# EAGLE design PiWing (EAGLE 9.0.1)
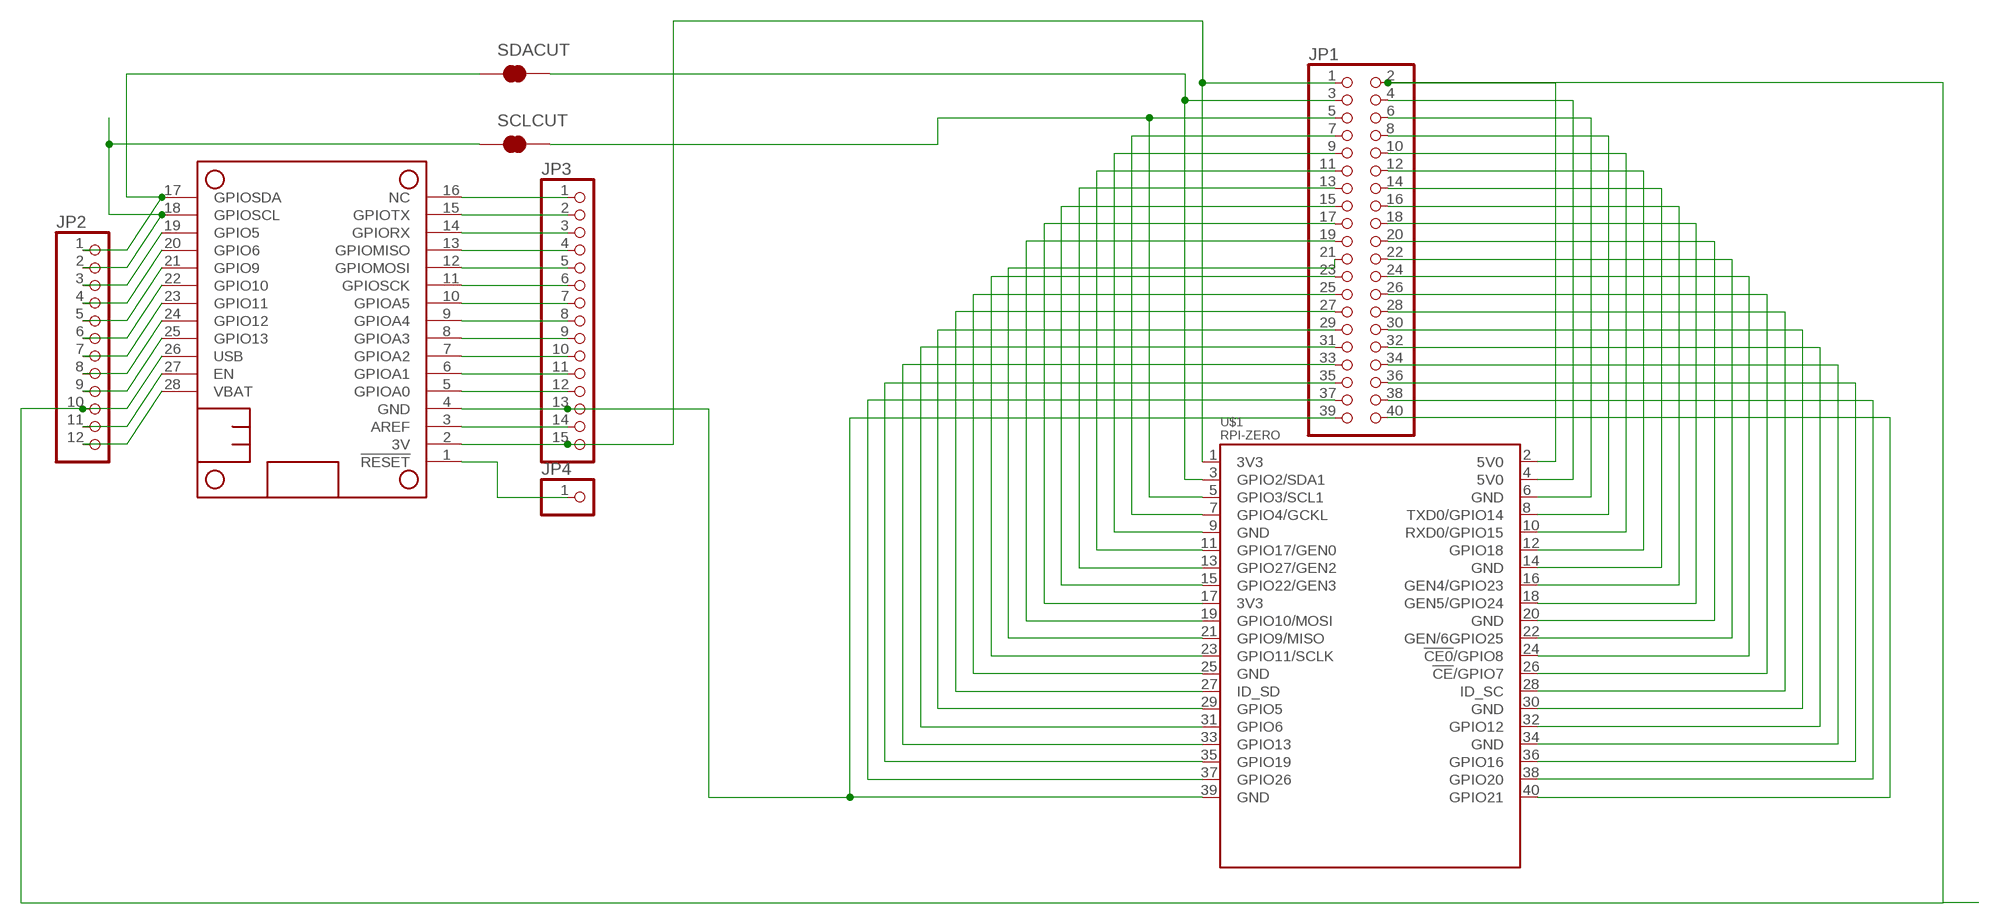
[diagram p0: schematic, sheet 1]

## Parts
JP1  PINHD-2X20-BIG  [2X20-BIG]
JP2  PINHD-1X12-CB  [1X12-CB]
JP3  PINHD-1X15-CB  [1X15-CB]
JP4  PINHD-1X1CB  [1X01-CLEANBIG]
MS1  FEATHERWING_NODIM  [FEATHERWING_DIM]
SCLCUT  JUMPER-SMT_2_NC_TRACE_SILK  [SMT-JUMPER_2_NC_TRACE_SILK]
SDACUT  JUMPER-SMT_2_NC_TRACE_SILK  [SMT-JUMPER_2_NC_TRACE_SILK]
U$1  RPI-ZERO  [RASPBERRYPI_BASTELSTUBE_V13_RASPI_BOARD_B+_FULL]

## Nets
3V: JP1.1 JP3.15 MS1.2(3V) U$1.1(3V3)
3V3@2: JP1.17 U$1.17(3V3)
5V0@2: JP1.4 U$1.4(5V0)
GND@1: JP1.9 U$1.9(GND)
GND@2: JP1.25 U$1.25(GND)
GND@3: JP1.39 JP3.13 MS1.4(GND) U$1.39(GND)
GND@4: JP1.14 U$1.14(GND)
GND@5: JP1.20 U$1.20(GND)
GND@6: JP1.30 U$1.30(GND)
GND@7: JP1.34 U$1.34(GND)
GND@8: JP1.6 U$1.6(GND)
N$1: JP1.3 SDACUT.2 U$1.3(GPIO2/SDA1)
N$2: JP1.5 SCLCUT.2 U$1.5(GPIO3/SCL1)
N$3: JP2.3 MS1.19(GPIO5)
N$4: JP2.4 MS1.20(GPIO6)
N$5: JP2.5 MS1.21(GPIO9)
N$6: JP2.6 MS1.22(GPIO10)
N$7: JP2.7 MS1.23(GPIO11)
N$8: JP2.8 MS1.24(GPIO12)
N$9: JP2.9 MS1.25(GPIO13)
N$10: JP2.11 MS1.27(EN)
N$11: JP3.1 MS1.16(NC)
N$12: JP3.2 MS1.15(GPIOTX)
N$13: JP3.3 MS1.14(GPIORX)
N$14: JP1.21 U$1.21(GPIO9/MISO)
N$15: JP1.19 U$1.19(GPIO10/MOSI)
N$16: JP1.23 U$1.23(GPIO11/SCLK)
N$17: JP3.7 MS1.10(GPIOA5)
N$18: JP3.8 MS1.9(GPIOA4)
N$19: JP3.9 MS1.8(GPIOA3)
N$20: JP3.10 MS1.7(GPIOA2)
N$21: JP3.11 MS1.6(GPIOA1)
N$22: JP3.12 MS1.5(GPIOA0)
N$23: JP3.6 MS1.11(GPIOSCK)
N$24: JP3.14 MS1.3(AREF)
N$25: JP4.1 MS1.1(!RESET)
N$26: JP1.11 U$1.11(GPIO17/GEN0)
N$27: JP3.5 MS1.12(GPIOMOSI)
N$28: JP3.4 MS1.13(GPIOMISO)
N$29: JP1.7 U$1.7(GPIO4/GCKL)
N$30: JP1.13 U$1.13(GPIO27/GEN2)
N$31: JP1.15 U$1.15(GPIO22/GEN3)
N$32: JP1.27 U$1.27(ID_SD)
N$34: JP2.1 MS1.17(GPIOSDA) SDACUT.1
N$35: JP2.2 MS1.18(GPIOSCL) SCLCUT.1
N$36: JP1.29 U$1.29(GPIO5)
N$37: JP1.31 U$1.31(GPIO6)
N$38: JP1.33 U$1.33(GPIO13)
N$39: JP1.35 U$1.35(GPIO19)
N$40: JP1.37 U$1.37(GPIO26)
N$41: JP1.16 U$1.16(GEN4/GPIO23)
N$42: JP1.18 U$1.18(GEN5/GPIO24)
N$43: JP1.8 U$1.8(TXD0/GPIO14)
N$44: JP1.10 U$1.10(RXD0/GPIO15)
N$45: JP1.12 U$1.12(GPIO18)
N$47: JP1.22 U$1.22(GEN/6GPIO25)
N$48: JP1.24 U$1.24(!CE0!/GPIO8)
N$49: JP1.26 U$1.26(!CE!/GPIO7)
N$50: JP1.28 U$1.28(ID_SC)
N$52: JP1.32 U$1.32(GPIO12)
N$54: JP1.36 U$1.36(GPIO16)
N$55: JP1.38 U$1.38(GPIO20)
N$56: JP1.40 U$1.40(GPIO21)
USB: JP1.2 JP2.10 MS1.26(USB) U$1.2(5V0)
VBAT: JP2.12 MS1.28(VBAT)

## Library data of the parts
JP1 = adafruit:PINHD-2X20: PIN HEADER
JP2 = adafruit:PINHD-1X12: PIN HEADER
JP3 = adafruit:PINHD-1X15: PIN HEADER
JP4 = adafruit:PINHD-1X1: Pin header 1x1 for 0.1" spacing With round pins
MS1 = adafruit:FEATHERWING
SCLCUT SDACUT = SparkFun-Jumpers:JUMPER-SMT_2_NC_TRACE: Normally closed trace jumper This jumper has a trace between two pads so it's normally closed (NC). Use a razor knife to open the connection. For best results follow the IPC guidelines for cutting traces: Cutout at least 0.063 mm (0.005 in). Remove all loose material to clean up the cut area. Seal the cut with an approved epoxy. Reapply solder to reclose the connection.
U$1 = RPI-Zero:RPI-ZERO

## Board
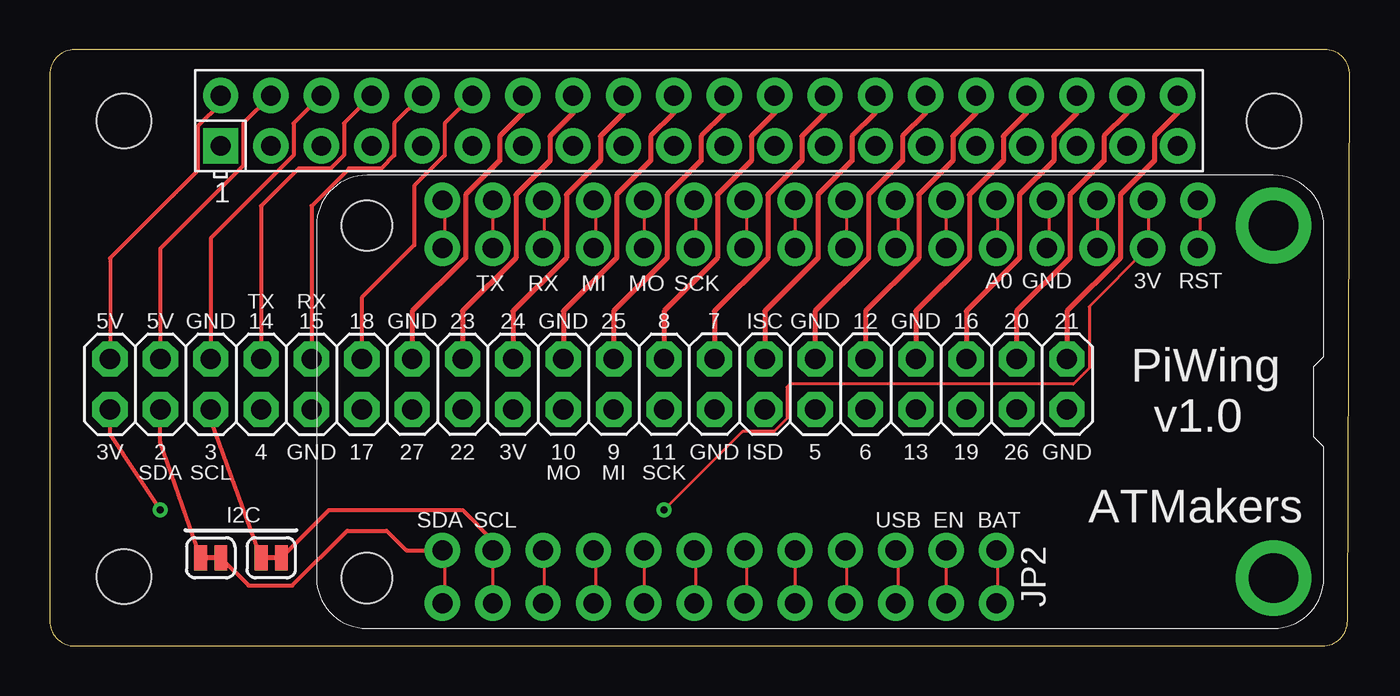
[diagram p1: board, top side]
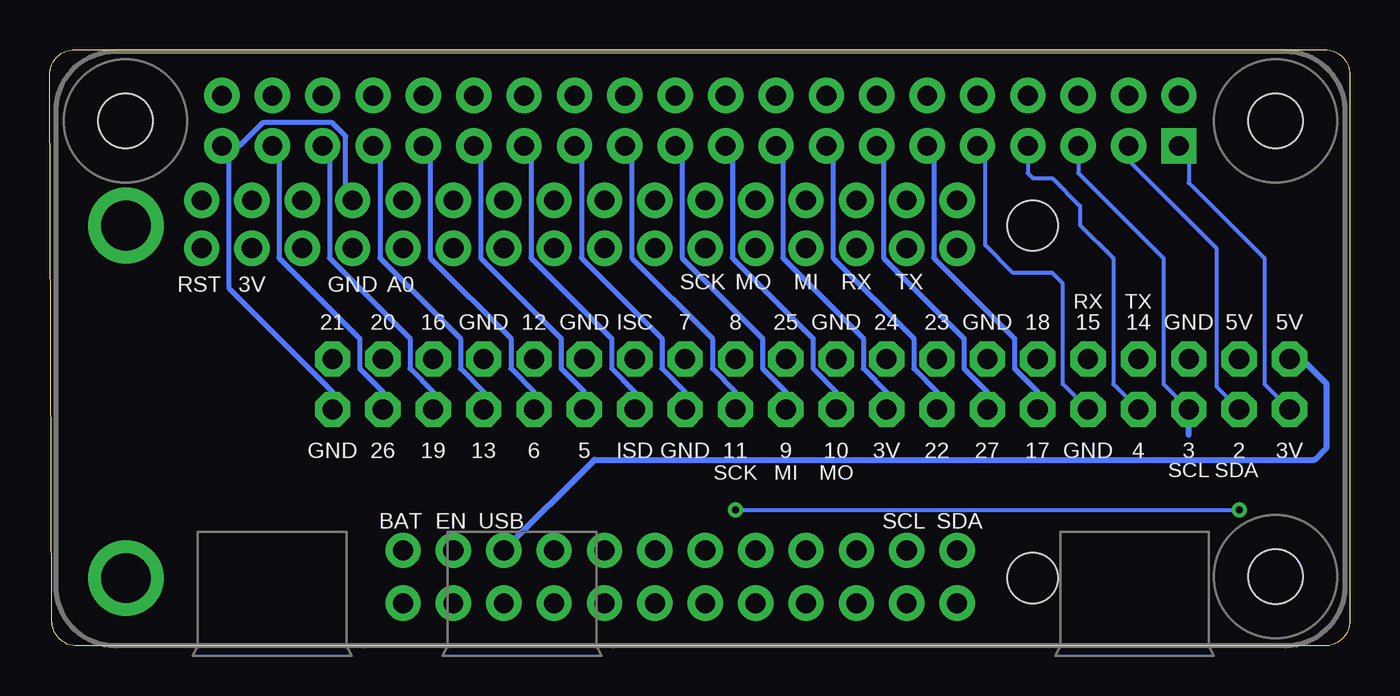
[diagram p2: board, bottom side, seen from below]

Size 65.58 x 30.09 mm. Coordinates in mm from the lower left corner, seen from the top.
Outline: 0,28.82 0,1.27 arc90 1.27,0 64.19,0 arc90 65.46,1.26 65.58,28.81 arc90 64.31,30.09 1.27,30.09 arc90 0,28.82
Copper layers (1*16): Top 0.035mm / dielectric 1.5mm / Bottom 0.035mm
Design rules "default": minimum track width 6mil, minimum drill 0.35mm, track to track 6mil, track to pad 6mil, pad to pad 6mil, via to via 6mil, smd to smd 6mil, copper to edge 40mil, drill to drill 6mil, minimum pad ring 10mil, minimum via ring 8mil, stop-mask expansion 4mil, vias tented up to drill 0mil, thermal gap 10mil

### Footprints (pad centres in the part's own frame; a part is rotated, then mirrored left to right if it is on the bottom)
2X20-BIG = drill 1.016 pad 1.778 octagon: 1 -24.13,-1.27; 2 -24.13,1.27; 3 -21.59,-1.27; 4 -21.59,1.27; 5 -19.05,-1.27; 6 -19.05,1.27; 7 -16.51,-1.27; 8 -16.51,1.27; 9 -13.97,-1.27; 10 -13.97,1.27; 11 -11.43,-1.27; 12 -11.43,1.27; 13 -8.89,-1.27; 14 -8.89,1.27; 15 -6.35,-1.27; 16 -6.35,1.27; 17 -3.81,-1.27; 18 -3.81,1.27; 19 -1.27,-1.27; 20 -1.27,1.27; 21 1.27,-1.27; 22 1.27,1.27; 23 3.81,-1.27; 24 3.81,1.27; 25 6.35,-1.27; 26 6.35,1.27; 27 8.89,-1.27; 28 8.89,1.27; 29 11.43,-1.27; 30 11.43,1.27; 31 13.97,-1.27; 32 13.97,1.27; 33 16.51,-1.27; 34 16.51,1.27; 35 19.05,-1.27; 36 19.05,1.27; 37 21.59,-1.27; 38 21.59,1.27; 39 24.13,-1.27; 40 24.13,1.27
1X12-CB = drill 1.016 pad 1.778: 1 -13.97,0; 2 -11.43,0; 3 -8.89,0; 4 -6.35,0; 5 -3.81,0; 6 -1.27,0; 7 1.27,0; 8 3.81,0; 9 6.35,0; 10 8.89,0; 11 11.43,0; 12 13.97,0
1X15-CB = drill 1.016 pad 1.778: 1 -17.78,0; 2 -15.24,0; 3 -12.7,0; 4 -10.16,0; 5 -7.62,0; 6 -5.08,0; 7 -2.54,0; 8 0,0; 9 2.54,0; 10 5.08,0; 11 7.62,0; 12 10.16,0; 13 12.7,0; 14 15.24,0; 15 17.78,0
1X01-CLEANBIG = drill 1.016 pad 1.778: 1 0,0
FEATHERWING_DIM = drill 1 pad 1.778: 1 6.35,1.27; 2 8.89,1.27; 3 11.43,1.27; 4 13.97,1.27; 5 16.51,1.27; 6 19.05,1.27; 7 21.59,1.27; 8 24.13,1.27; 9 26.67,1.27; 10 29.21,1.27; 11 31.75,1.27; 12 34.29,1.27; 13 36.83,1.27; 14 39.37,1.27; 15 41.91,1.27; 16 44.45,1.27; 17 44.45,21.59; 18 41.91,21.59; 19 39.37,21.59; 20 36.83,21.59; 21 34.29,21.59; 22 31.75,21.59; 23 29.21,21.59; 24 26.67,21.59; 25 24.13,21.59; 26 21.59,21.59; 27 19.05,21.59; 28 16.51,21.59 | drill 2.5 pad 3.81: P$1 2.54,20.32; P$2 2.54,2.54 | hole 2.54: 48.26,20.32; 48.26,2.54
SMT-JUMPER_2_NC_TRACE_SILK = smd 0.635 x 1.27: 1 -0.508,0; 2 0.508,0
RASPBERRYPI_BASTELSTUBE_V13_RASPI_BOARD_B+_FULL = drill 1 pad 1.778 square: 1 8.37,25.23 | drill 1 pad 1.778: 2 8.37,27.77; 3 10.91,25.23; 4 10.91,27.77; 5 13.45,25.23; 6 13.45,27.77; 7 15.99,25.23; 8 15.99,27.77; 9 18.53,25.23; 10 18.53,27.77; 11 21.07,25.23; 12 21.07,27.77; 13 23.61,25.23; 14 23.61,27.77; 15 26.15,25.23; 16 26.15,27.77; 17 28.69,25.23; 18 28.69,27.77; 19 31.23,25.23; 20 31.23,27.77; 21 33.77,25.23; 22 33.77,27.77; 23 36.31,25.23; 24 36.31,27.77; 25 38.85,25.23; 26 38.85,27.77; 27 41.39,25.23; 28 41.39,27.77; 29 43.93,25.23; 30 43.93,27.77; 31 46.47,25.23; 32 46.47,27.77; 33 49.01,25.23; 34 49.01,27.77; 35 51.55,25.23; 36 51.55,27.77; 37 54.09,25.23; 38 54.09,27.77; 39 56.63,25.23; 40 56.63,27.77 | hole 2.75: 3.5,3.5; 3.5,26.5; 61.5,26.5

### Placement (x,y rotation side)
JP1  27.18,13.21 0 top
JP2  33.78,4.83 0 top
JP3  37.59,20.07 0 top
JP4  57.91,20.07 0 top
MS1  64.26,23.75 180 top
SCLCUT  11.18,4.45 180 top
SDACUT  8.13,4.45 180 top
U$1  0.25,0 0 top

### Tracks (layer width: path | path; a pad name or v marks a point on that pad's centre or on a via)
3V  (via drill 0.35)
  Top 0.152: MS1.2 55.42,22.45 55.42,20.32 JP3.15 52.43,17.12 52.43,14.02 51.62,13.21 37.34,13.21 37.19,13.06 37.19,11.47 36.53,10.82 34.95,10.82 v30.99,6.86
  Top 0.203: v5.59,6.86 3.05,10.67 JP1.1
  Bottom 0.203: U$1.1 8.13,24.73 8.13,23.37 4.32,19.56 4.32,13.21 JP1.1 | v30.99,6.86 v5.59,6.86
3V3@2
  Bottom 0.254: U$1.17 28.6,24.89 28.6,19.58 24.54,15.52 24.54,13.99 23.37,12.83 JP1.17
5V0@2
  Top 0.203: U$1.4 9.77,26.37 9.77,24.24 5.59,20.06 JP1.4
GND@1
  Bottom 0.203: JP1.9 14.48,13.21 14.48,18.29 15.01,18.82 16.99,18.82 18.39,20.22 18.39,24.84 U$1.9
GND@2
  Bottom 0.254: U$1.25 38.76,24.89 38.76,19.58 34.7,15.52 34.7,13.99 33.53,12.83 JP1.25
GND@3
  Top 0.152: JP3.13 50.39,20.32 50.39,22.45 MS1.4
  Bottom 0.254: MS1.4 50.64,22.82 50.64,25.71 51.32,26.4 54.83,26.4 56,25.23 U$1.39 56.54,24.89 56.54,18.06 51.31,12.83 JP1.39
GND@4
  Top 0.254: U$1.14 23.86,26.88 22.7,25.71 22.7,24.47 20.98,22.76 20.98,19.58 18.29,16.89 JP1.14
GND@5
  Top 0.254: U$1.20 31.48,26.88 30.32,25.71 30.32,24.47 28.6,22.76 28.6,19.58 25.91,16.89 JP1.20
GND@6
  Top 0.254: U$1.30 44.18,26.88 43.02,25.71 43.02,24.47 41.3,22.76 41.3,19.58 38.61,16.89 JP1.30
GND@7
  Top 0.254: U$1.34 49.26,26.88 48.1,25.71 48.1,24.47 46.38,22.76 46.38,19.58 43.69,16.89 JP1.34
GND@8
  Top 0.203: U$1.6 12.31,26.37 12.31,24.76 8.13,20.58 JP1.6
N$1
  Top 0.203: SDACUT.2 5.59,10.29 JP1.3
  Bottom 0.203: U$1.3 11.16,24.5 6.73,20.07 6.73,13.08 JP1.3
N$2
  Top 0.203: SCLCUT.2 8.13,11.43 JP1.5
  Bottom 0.203: U$1.5 13.7,23.86 9.4,19.56 9.4,13.21 JP1.5
  Bottom 0.305: 8.13,10.67 JP1.5
N$3
  Top 0.152: MS1.19 24.94,2.18 24.94,4.77 JP2.3
N$4
  Top 0.152: MS1.20 27.53,2.18 27.53,4.77 JP2.4
N$5
  Top 0.152: JP2.5 MS1.21
N$6
  Top 0.152: MS1.22 32.56,2.18 32.56,4.77 JP2.6
N$7
  Top 0.152: MS1.23 35.15,2.18 35.15,4.77 JP2.7
N$8
  Top 0.152: JP2.8 MS1.24
N$9
  Top 0.152: MS1.25 40.18,2.18 40.18,4.77 JP2.9
N$10
  Top 0.152: JP2.11 MS1.27
N$11
  Top 0.152: JP3.1 19.91,20.32 19.91,22.45 MS1.16
N$12
  Top 0.152: MS1.15 JP3.2
N$13
  Top 0.152: JP3.3 24.94,20.32 24.94,22.45 MS1.14
N$14
  Bottom 0.254: U$1.21 33.68,24.89 33.68,19.58 29.62,15.52 29.62,13.99 28.45,12.83 JP1.21
N$15
  Bottom 0.254: U$1.19 31.14,24.89 31.14,19.58 27.08,15.52 27.08,13.99 25.91,12.83 JP1.19
N$16
  Bottom 0.254: U$1.23 36.22,24.89 36.22,19.58 32.16,15.52 32.16,13.99 30.99,12.83 JP1.23
N$17
  Top 0.152: JP3.7 35.15,20.32 35.15,22.45 MS1.10
N$18
  Top 0.152: MS1.9 JP3.8
N$19
  Top 0.152: JP3.9 40.18,20.32 40.18,22.45 MS1.8
N$20
  Top 0.152: JP3.10 42.77,20.32 42.77,22.45 MS1.7
N$21
  Top 0.152: MS1.6 JP3.11
N$22
  Top 0.152: JP3.12 47.8,20.32 47.8,22.45 MS1.5
N$23
  Top 0.152: JP3.6 32.56,20.32 32.56,22.45 MS1.11
N$24
  Top 0.152: MS1.3 JP3.14
N$25
  Top 0.152: JP4.1 58.01,20.32 58.01,22.45 MS1.1
N$26
  Bottom 0.254: U$1.11 20.98,24.89 20.98,19.58 16.92,15.52 16.92,13.99 15.75,12.83 JP1.11
N$27
  Top 0.152: MS1.12 JP3.5
N$28
  Top 0.152: JP3.4 27.53,20.32 27.53,22.45 MS1.13
N$29
  Bottom 0.203: U$1.7 16.24,23.86 15.98,23.6 15.01,23.6 13.61,22.2 13.61,21.23 11.94,19.56 11.94,13.21 JP1.7
N$30
  Bottom 0.254: U$1.13 23.52,24.89 23.52,19.58 19.46,15.52 19.46,13.99 18.29,12.83 JP1.13
N$31
  Bottom 0.254: U$1.15 26.06,24.89 26.06,19.58 22,15.52 22,13.99 20.83,12.83 JP1.15
N$32
  Bottom 0.254: U$1.27 41.3,24.89 41.3,19.58 37.24,15.52 37.24,13.99 36.07,12.83 JP1.27
N$34
  Top 0.152: MS1.17 19.91,2.18 19.91,4.77 JP2.1
  Top 0.203: SDACUT.1 10.03,3.05 12.24,3.05 15.01,5.82 16.99,5.82 17.98,4.83 JP2.1
N$35
  Top 0.152: JP2.2 22.35,4.32 MS1.18
  Top 0.203: SCLCUT.1 14.1,6.86 20.83,6.86 22.35,5.33 22.35,4.32
N$36
  Bottom 0.254: U$1.29 43.84,24.89 43.84,19.58 39.78,15.52 39.78,13.99 38.61,12.83 JP1.29
N$37
  Bottom 0.254: U$1.31 46.38,24.89 46.38,19.58 42.32,15.52 42.32,13.99 41.15,12.83 JP1.31
N$38
  Bottom 0.254: U$1.33 48.92,24.89 48.92,19.58 44.86,15.52 44.86,13.99 43.69,12.83 JP1.33
N$39
  Bottom 0.254: JP1.35 46.23,12.83 47.4,13.99 47.4,15.52 51.46,19.58 51.46,24.89 U$1.35
N$40
  Bottom 0.254: U$1.37 54,24.89 54,19.58 49.94,15.52 49.94,13.99 48.77,12.83 JP1.37
N$41
  Top 0.254: U$1.16 26.4,26.88 25.24,25.71 25.24,24.47 23.52,22.76 23.52,19.58 20.83,16.89 JP1.16
N$42
  Top 0.254: U$1.18 28.94,26.88 27.78,25.71 27.78,24.47 26.06,22.76 26.06,19.58 23.37,16.89 JP1.18
N$43
  Top 0.203: JP1.8 10.67,22.19 12.56,24.09 14.18,24.09 14.85,24.76 14.85,26.37 U$1.8
N$44
  Top 0.203: JP1.10 13.21,22.19 15.1,24.09 16.72,24.09 17.39,24.76 17.39,26.37 U$1.10
N$45
  Top 0.203: U$1.12 19.93,26.37 19.93,24.76 18.39,23.22 18.39,20.22 15.75,17.58 JP1.12
N$47
  Top 0.254: U$1.22 34.02,26.88 32.86,25.71 32.86,24.47 31.14,22.76 31.14,19.58 28.45,16.89 JP1.22
N$48
  Top 0.254: U$1.24 36.56,26.88 35.4,25.71 35.4,24.47 33.68,22.76 33.68,19.58 30.99,16.89 JP1.24
N$49
  Top 0.254: U$1.26 39.1,26.88 37.94,25.71 37.94,24.47 36.22,22.76 36.22,19.58 33.53,16.89 JP1.26
N$50
  Top 0.254: U$1.28 41.64,26.88 40.48,25.71 40.48,24.47 38.76,22.76 38.76,19.58 36.07,16.89 JP1.28
N$52
  Top 0.254: U$1.32 46.72,26.88 45.56,25.71 45.56,24.47 43.84,22.76 43.84,19.58 41.15,16.89 JP1.32
N$54
  Top 0.254: U$1.36 51.8,26.88 50.64,25.71 50.64,24.47 48.92,22.76 48.92,19.58 46.23,16.89 JP1.36
N$55
  Top 0.254: U$1.38 54.34,26.88 53.18,25.71 53.18,24.47 51.46,22.76 51.46,19.58 48.77,16.89 JP1.38
N$56
  Top 0.254: U$1.40 56.88,26.88 55.72,25.71 55.72,24.47 54,22.76 54,19.58 51.31,16.89 JP1.40
USB
  Top 0.152: MS1.26 42.77,2.18 42.77,4.77 JP2.10
  Top 0.203: U$1.2 8.62,27.37 7.48,26.22 7.48,23.99 3.05,19.56 JP1.2
  Bottom 0.305: JP2.10 38.1,9.4 1.78,9.4 1.17,10.01 1.17,13.21 2.44,14.48 JP1.2
VBAT
  Top 0.152: MS1.28 47.8,2.18 47.8,4.77 JP2.12

### Text on the board
tNames: TX | RX | MI | MO | SCK | A0 | GND | 3V | RST | TX | RX | 5V | 5V | GND | 14 | 15 | 18 | GND | 23 | 24 | GND | 25 | 8 | 7 | ISC | GND | 12 | GND | 16 | 20 | 21 | PiWing | v1.0 | 3V | 2 | 3 | 4 | GND | 17 | 27 | 22 | 3V | 10 | 9 | 11 | GND | ISD | 5 | 6 | 13 | 19 | 26 | GND | SDA | SCL | MO | MI | SCK | I2C | SDA | SCL | USB | EN | BAT | ATMakers
bNames: TX | RX | MI | MO | SCK | A0 | GND | 3V | RST | TX | RX | 5V | 5V | GND | 14 | 15 | 18 | GND | 23 | 24 | GND | 25 | 8 | 7 | ISC | GND | 12 | GND | 16 | 20 | 21 | 3V | 2 | 3 | 4 | GND | 17 | 27 | 22 | 3V | 10 | 9 | 11 | GND | ISD | 5 | 6 | 13 | 19 | 26 | GND | SDA | SCL | MO | MI | SCK | SDA | SCL | USB | EN | BAT